# EAGLE design matrix (EAGLE 5.07)

## Sheet 1 of 2
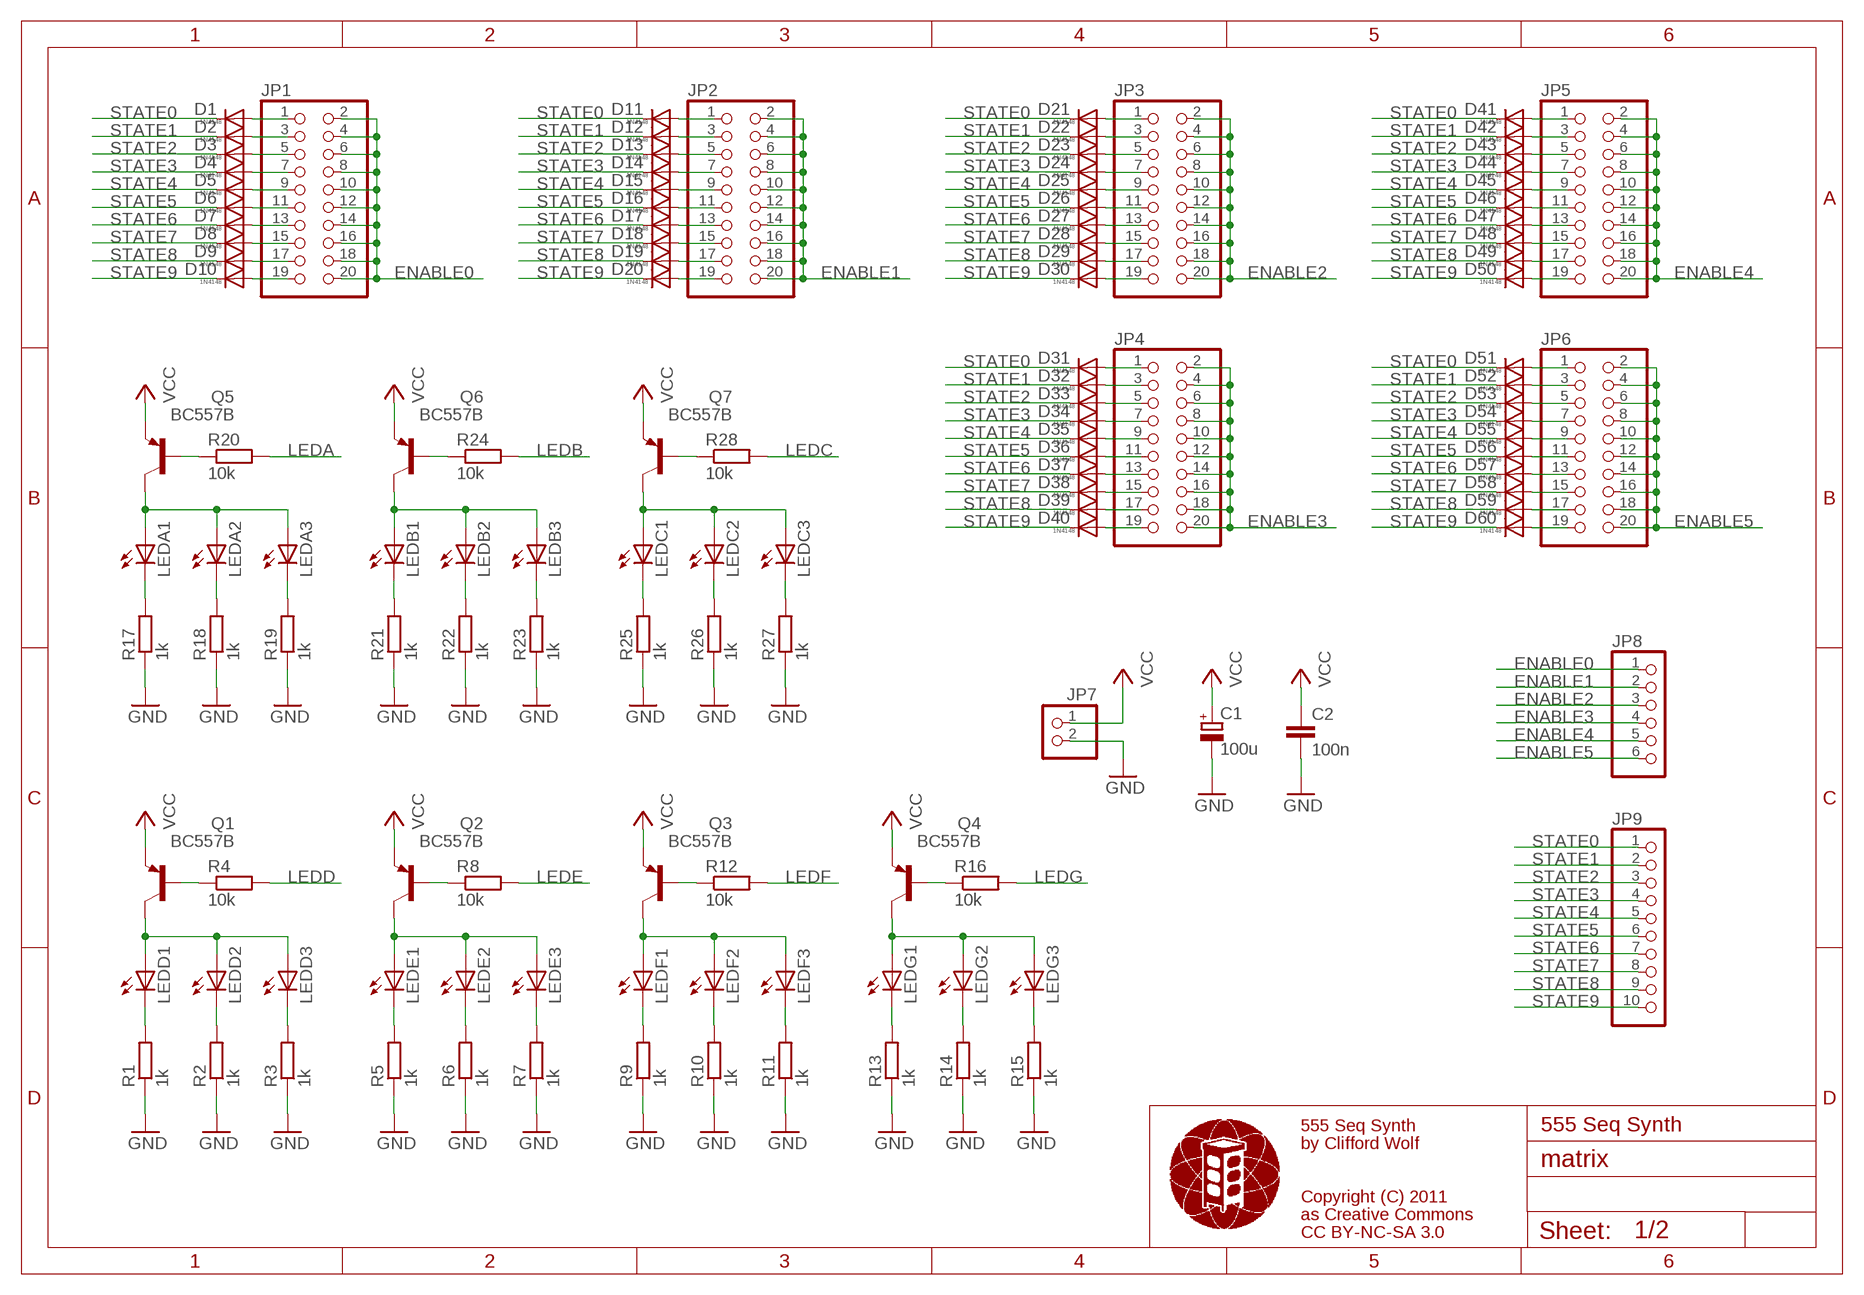
[diagram p0: schematic, sheet 1]

### Parts
C1  100u  CPOLE5-10,5L  [E5-10,5L]
C2  100n  C050-030X075  [C050-030X075]
D1  1N4148  [DO35-7]
D2  1N4148  [DO35-7]
D3  1N4148  [DO35-7]
D4  1N4148  [DO35-7]
D5  1N4148  [DO35-7]
D6  1N4148  [DO35-7]
D7  1N4148  [DO35-7]
D8  1N4148  [DO35-7]
D9  1N4148  [DO35-7]
D10  1N4148  [DO35-7]
D11  1N4148  [DO35-7]
D12  1N4148  [DO35-7]
D13  1N4148  [DO35-7]
D14  1N4148  [DO35-7]
D15  1N4148  [DO35-7]
D16  1N4148  [DO35-7]
D17  1N4148  [DO35-7]
D18  1N4148  [DO35-7]
D19  1N4148  [DO35-7]
D20  1N4148  [DO35-7]
D21  1N4148  [DO35-7]
D22  1N4148  [DO35-7]
D23  1N4148  [DO35-7]
D24  1N4148  [DO35-7]
D25  1N4148  [DO35-7]
D26  1N4148  [DO35-7]
D27  1N4148  [DO35-7]
D28  1N4148  [DO35-7]
D29  1N4148  [DO35-7]
D30  1N4148  [DO35-7]
D31  1N4148  [DO35-7]
D32  1N4148  [DO35-7]
D33  1N4148  [DO35-7]
D34  1N4148  [DO35-7]
D35  1N4148  [DO35-7]
D36  1N4148  [DO35-7]
D37  1N4148  [DO35-7]
D38  1N4148  [DO35-7]
D39  1N4148  [DO35-7]
D40  1N4148  [DO35-7]
D41  1N4148  [DO35-7]
D42  1N4148  [DO35-7]
D43  1N4148  [DO35-7]
D44  1N4148  [DO35-7]
D45  1N4148  [DO35-7]
D46  1N4148  [DO35-7]
D47  1N4148  [DO35-7]
D48  1N4148  [DO35-7]
D49  1N4148  [DO35-7]
D50  1N4148  [DO35-7]
D51  1N4148  [DO35-7]
D52  1N4148  [DO35-7]
D53  1N4148  [DO35-7]
D54  1N4148  [DO35-7]
D55  1N4148  [DO35-7]
D56  1N4148  [DO35-7]
D57  1N4148  [DO35-7]
D58  1N4148  [DO35-7]
D59  1N4148  [DO35-7]
D60  1N4148  [DO35-7]
JP1  PINHD-2X10  [2X10]
JP2  PINHD-2X10  [2X10]
JP3  PINHD-2X10  [2X10]
JP4  PINHD-2X10  [2X10]
JP5  PINHD-2X10  [2X10]
JP6  PINHD-2X10  [2X10]
JP7  PINHD-1X2  [1X02]
JP8  PINHD-1X6  [1X06]
JP9  PINHD-1X10  [1X10]
LEDA1  LED5MM  [LED5MM]
LEDA2  LED5MM  [LED5MM]
LEDA3  LED5MM  [LED5MM]
LEDB1  LED5MM  [LED5MM]
LEDB2  LED5MM  [LED5MM]
LEDB3  LED5MM  [LED5MM]
LEDC1  LED5MM  [LED5MM]
LEDC2  LED5MM  [LED5MM]
LEDC3  LED5MM  [LED5MM]
LEDD1  LED5MM  [LED5MM]
LEDD2  LED5MM  [LED5MM]
LEDD3  LED5MM  [LED5MM]
LEDE1  LED5MM  [LED5MM]
LEDE2  LED5MM  [LED5MM]
LEDE3  LED5MM  [LED5MM]
LEDF1  LED5MM  [LED5MM]
LEDF2  LED5MM  [LED5MM]
LEDF3  LED5MM  [LED5MM]
LEDG1  LED5MM  [LED5MM]
LEDG2  LED5MM  [LED5MM]
LEDG3  LED5MM  [LED5MM]
Q1  BC557B  [TO92]
Q2  BC557B  [TO92]
Q3  BC557B  [TO92]
Q4  BC557B  [TO92]
Q5  BC557B  [TO92]
Q6  BC557B  [TO92]
Q7  BC557B  [TO92]
R1  1k  R0309/10  [0309/10]
R2  1k  R0309/10  [0309/10]
R3  1k  R0309/10  [0309/10]
R4  10k  R0309/10  [0309/10]
R5  1k  R0309/10  [0309/10]
R6  1k  R0309/10  [0309/10]
R7  1k  R0309/10  [0309/10]
R8  10k  R0309/10  [0309/10]
R9  1k  R0309/10  [0309/10]
R10  1k  R0309/10  [0309/10]
R11  1k  R0309/10  [0309/10]
R12  10k  R0309/10  [0309/10]
R13  1k  R0309/10  [0309/10]
R14  1k  R0309/10  [0309/10]
R15  1k  R0309/10  [0309/10]
R16  10k  R0309/10  [0309/10]
R17  1k  R0309/10  [0309/10]
R18  1k  R0309/10  [0309/10]
R19  1k  R0309/10  [0309/10]
R20  10k  R0309/10  [0309/10]
R21  1k  R0309/10  [0309/10]
R22  1k  R0309/10  [0309/10]
R23  1k  R0309/10  [0309/10]
R24  10k  R0309/10  [0309/10]
R25  1k  R0309/10  [0309/10]
R26  1k  R0309/10  [0309/10]
R27  1k  R0309/10  [0309/10]
R28  10k  R0309/10  [0309/10]

### Nets
ENABLE0: JP1.2 JP1.4 JP1.6 JP1.8 JP1.10 JP1.12 JP1.14 JP1.16 JP1.18 JP1.20 JP8.1
ENABLE1: JP2.2 JP2.4 JP2.6 JP2.8 JP2.10 JP2.12 JP2.14 JP2.16 JP2.18 JP2.20 JP8.2
ENABLE2: JP3.2 JP3.4 JP3.6 JP3.8 JP3.10 JP3.12 JP3.14 JP3.16 JP3.18 JP3.20 JP8.3
ENABLE3: JP4.2 JP4.4 JP4.6 JP4.8 JP4.10 JP4.12 JP4.14 JP4.16 JP4.18 JP4.20 JP8.4
ENABLE4: JP5.2 JP5.4 JP5.6 JP5.8 JP5.10 JP5.12 JP5.14 JP5.16 JP5.18 JP5.20 JP8.5
ENABLE5: JP6.2 JP6.4 JP6.6 JP6.8 JP6.10 JP6.12 JP6.14 JP6.16 JP6.18 JP6.20 JP8.6
GND [pwr]: C1.- C2.2 JP7.2 R1.1 R2.1 R3.1 R5.1 R6.1 R7.1 R9.1 R10.1 R11.1 R13.1 R14.1 R15.1 R17.1 R18.1 R19.1 R21.1 R22.1 R23.1 R25.1 R26.1 R27.1
LEDA: R20.2 ; also sheet 2
LEDB: R24.2 ; also sheet 2
LEDC: R28.2 ; also sheet 2
LEDD: R4.2 ; also sheet 2
LEDE: R8.2 ; also sheet 2
LEDF: R12.2 ; also sheet 2
LEDG: R16.2 ; also sheet 2
N$1: D1.A JP1.1
N$2: D2.A JP1.3
N$3: D3.A JP1.5
N$4: D4.A JP1.7
N$5: D5.A JP1.9
N$6: D6.A JP1.11
N$7: D7.A JP1.13
N$8: D8.A JP1.15
N$9: D9.A JP1.17
N$10: D10.A JP1.19
N$11: D11.A JP2.1
N$12: D12.A JP2.3
N$13: D13.A JP2.5
N$14: D14.A JP2.7
N$15: D15.A JP2.9
N$16: D16.A JP2.11
N$17: D17.A JP2.13
N$18: D18.A JP2.15
N$19: D19.A JP2.17
N$20: D20.A JP2.19
N$21: D21.A JP3.1
N$22: D22.A JP3.3
N$23: D23.A JP3.5
N$24: D24.A JP3.7
N$25: D25.A JP3.9
N$26: D26.A JP3.11
N$27: D27.A JP3.13
N$28: D28.A JP3.15
N$29: D29.A JP3.17
N$30: D30.A JP3.19
N$31: D31.A JP4.1
N$32: D32.A JP4.3
N$33: D33.A JP4.5
N$34: D34.A JP4.7
N$35: D35.A JP4.9
N$36: D36.A JP4.11
N$37: D37.A JP4.13
N$38: D38.A JP4.15
N$39: D39.A JP4.17
N$40: D40.A JP4.19
N$41: D41.A JP5.1
N$42: D42.A JP5.3
N$43: D43.A JP5.5
N$44: D44.A JP5.7
N$45: D45.A JP5.9
N$46: D46.A JP5.11
N$47: D47.A JP5.13
N$48: D48.A JP5.15
N$49: D49.A JP5.17
N$50: D50.A JP5.19
N$51: D51.A JP6.1
N$52: D52.A JP6.3
N$53: D53.A JP6.5
N$54: D54.A JP6.7
N$55: D55.A JP6.9
N$56: D56.A JP6.11
N$57: D57.A JP6.13
N$58: D58.A JP6.15
N$59: D59.A JP6.17
N$60: D60.A JP6.19
N$61 [led]: LEDD1.K(C) R1.2
N$62 [led]: LEDD2.K(C) R2.2
N$63 [led]: LEDD3.K(C) R3.2
N$64 [led]: LEDE1.K(C) R5.2
N$65 [led]: LEDD1.A LEDD2.A LEDD3.A Q1.3(C)
N$66: Q1.2(B) R4.1
N$67 [led]: LEDE2.K(C) R6.2
N$68 [led]: LEDE3.K(C) R7.2
N$69 [led]: LEDE1.A LEDE2.A LEDE3.A Q2.3(C)
N$70: Q2.2(B) R8.1
N$71 [led]: LEDF1.K(C) R9.2
N$72 [led]: LEDF2.K(C) R10.2
N$73 [led]: LEDF3.K(C) R11.2
N$74 [led]: LEDF1.A LEDF2.A LEDF3.A Q3.3(C)
N$75: Q3.2(B) R12.1
N$76 [led]: LEDG1.K(C) R13.2
N$77 [led]: LEDG2.K(C) R14.2
N$78 [led]: LEDG3.K(C) R15.2
N$79 [led]: LEDG1.A LEDG2.A LEDG3.A Q4.3(C)
N$80: Q4.2(B) R16.1
N$81 [led]: LEDA1.K(C) R17.2
N$82 [led]: LEDA2.K(C) R18.2
N$83 [led]: LEDA3.K(C) R19.2
N$84 [led]: LEDA1.A LEDA2.A LEDA3.A Q5.3(C)
N$85: Q5.2(B) R20.1
N$86 [led]: LEDB1.K(C) R21.2
N$87 [led]: LEDB2.K(C) R22.2
N$88 [led]: LEDB3.K(C) R23.2
N$89 [led]: LEDB1.A LEDB2.A LEDB3.A Q6.3(C)
N$90: Q6.2(B) R24.1
N$91 [led]: LEDC1.K(C) R25.2
N$92 [led]: LEDC2.K(C) R26.2
N$93 [led]: LEDC3.K(C) R27.2
N$94 [led]: LEDC1.A LEDC2.A LEDC3.A Q7.3(C)
N$95: Q7.2(B) R28.1
STATE0: D1.C D11.C D21.C D31.C D41.C D51.C JP9.1 ; also sheet 2
STATE1: D2.C D12.C D22.C D32.C D42.C D52.C JP9.2 ; also sheet 2
STATE2: D3.C D13.C D23.C D33.C D43.C D53.C JP9.3 ; also sheet 2
STATE3: D4.C D14.C D24.C D34.C D44.C D54.C JP9.4 ; also sheet 2
STATE4: D5.C D15.C D25.C D35.C D45.C D55.C JP9.5 ; also sheet 2
STATE5: D6.C D16.C D26.C D36.C D46.C D56.C JP9.6 ; also sheet 2
STATE6: D7.C D17.C D27.C D37.C D47.C D57.C JP9.7 ; also sheet 2
STATE7: D8.C D18.C D28.C D38.C D48.C D58.C JP9.8 ; also sheet 2
STATE8: D9.C D19.C D29.C D39.C D49.C D59.C JP9.9 ; also sheet 2
STATE9: D10.C D20.C D30.C D40.C D50.C D60.C JP9.10 ; also sheet 2
VCC [pwr]: C1.+ C2.1 JP7.1 Q1.1(E) Q2.1(E) Q3.1(E) Q4.1(E) Q5.1(E) Q6.1(E) Q7.1(E)

### Notes on the sheet
- 555 Seq Synth | 555 Seq Synth
- by Clifford Wolf
- Copyright (C) 2011
- as Creative Commons
- CC BY-NC-SA 3.0

## Sheet 2 of 2
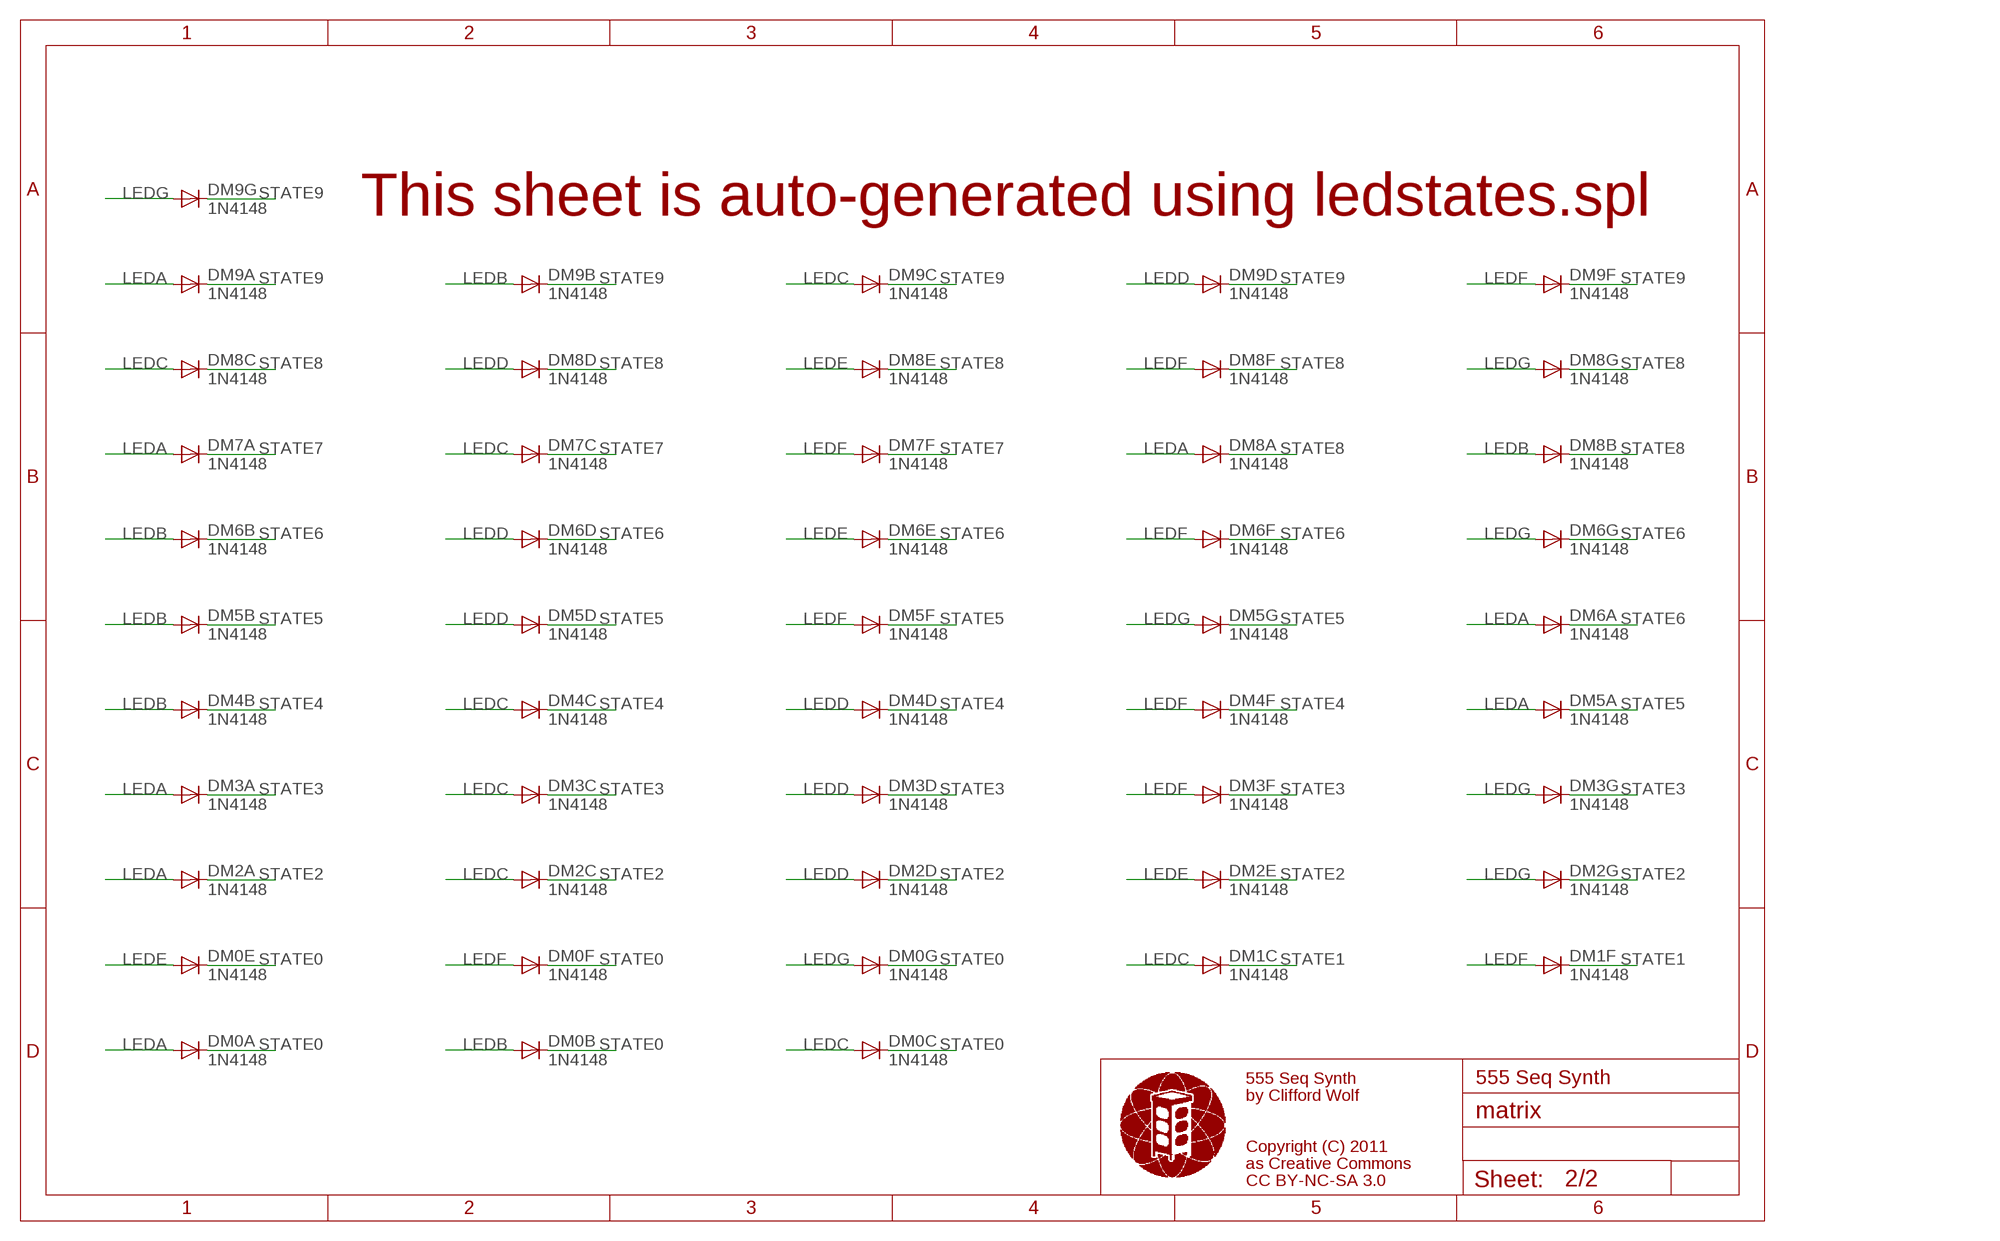
[diagram p1: schematic, sheet 2]

### Parts
DM0A  1N4148  [DO35-7]
DM0B  1N4148  [DO35-7]
DM0C  1N4148  [DO35-7]
DM0E  1N4148  [DO35-7]
DM0F  1N4148  [DO35-7]
DM0G  1N4148  [DO35-7]
DM1C  1N4148  [DO35-7]
DM1F  1N4148  [DO35-7]
DM2A  1N4148  [DO35-7]
DM2C  1N4148  [DO35-7]
DM2D  1N4148  [DO35-7]
DM2E  1N4148  [DO35-7]
DM2G  1N4148  [DO35-7]
DM3A  1N4148  [DO35-7]
DM3C  1N4148  [DO35-7]
DM3D  1N4148  [DO35-7]
DM3F  1N4148  [DO35-7]
DM3G  1N4148  [DO35-7]
DM4B  1N4148  [DO35-7]
DM4C  1N4148  [DO35-7]
DM4D  1N4148  [DO35-7]
DM4F  1N4148  [DO35-7]
DM5A  1N4148  [DO35-7]
DM5B  1N4148  [DO35-7]
DM5D  1N4148  [DO35-7]
DM5F  1N4148  [DO35-7]
DM5G  1N4148  [DO35-7]
DM6A  1N4148  [DO35-7]
DM6B  1N4148  [DO35-7]
DM6D  1N4148  [DO35-7]
DM6E  1N4148  [DO35-7]
DM6F  1N4148  [DO35-7]
DM6G  1N4148  [DO35-7]
DM7A  1N4148  [DO35-7]
DM7C  1N4148  [DO35-7]
DM7F  1N4148  [DO35-7]
DM8A  1N4148  [DO35-7]
DM8B  1N4148  [DO35-7]
DM8C  1N4148  [DO35-7]
DM8D  1N4148  [DO35-7]
DM8E  1N4148  [DO35-7]
DM8F  1N4148  [DO35-7]
DM8G  1N4148  [DO35-7]
DM9A  1N4148  [DO35-7]
DM9B  1N4148  [DO35-7]
DM9C  1N4148  [DO35-7]
DM9D  1N4148  [DO35-7]
DM9F  1N4148  [DO35-7]
DM9G  1N4148  [DO35-7]

### Nets
LEDA: DM0A.A DM2A.A DM3A.A DM5A.A DM6A.A DM7A.A DM8A.A DM9A.A ; also sheet 1
LEDB: DM0B.A DM4B.A DM5B.A DM6B.A DM8B.A DM9B.A ; also sheet 1
LEDC: DM0C.A DM1C.A DM2C.A DM3C.A DM4C.A DM7C.A DM8C.A DM9C.A ; also sheet 1
LEDD: DM2D.A DM3D.A DM4D.A DM5D.A DM6D.A DM8D.A DM9D.A ; also sheet 1
LEDE: DM0E.A DM2E.A DM6E.A DM8E.A ; also sheet 1
LEDF: DM0F.A DM1F.A DM3F.A DM4F.A DM5F.A DM6F.A DM7F.A DM8F.A DM9F.A ; also sheet 1
LEDG: DM0G.A DM2G.A DM3G.A DM5G.A DM6G.A DM8G.A DM9G.A ; also sheet 1
STATE0: DM0A.C DM0B.C DM0C.C DM0E.C DM0F.C DM0G.C ; also sheet 1
STATE1: DM1C.C DM1F.C ; also sheet 1
STATE2: DM2A.C DM2C.C DM2D.C DM2E.C DM2G.C ; also sheet 1
STATE3: DM3A.C DM3C.C DM3D.C DM3F.C DM3G.C ; also sheet 1
STATE4: DM4B.C DM4C.C DM4D.C DM4F.C ; also sheet 1
STATE5: DM5A.C DM5B.C DM5D.C DM5F.C DM5G.C ; also sheet 1
STATE6: DM6A.C DM6B.C DM6D.C DM6E.C DM6F.C DM6G.C ; also sheet 1
STATE7: DM7A.C DM7C.C DM7F.C ; also sheet 1
STATE8: DM8A.C DM8B.C DM8C.C DM8D.C DM8E.C DM8F.C DM8G.C ; also sheet 1
STATE9: DM9A.C DM9B.C DM9C.C DM9D.C DM9F.C DM9G.C ; also sheet 1

### Notes on the sheet
- This sheet is auto-generated using ledstates.spl
- 555 Seq Synth | 555 Seq Synth
- by Clifford Wolf
- Copyright (C) 2011
- as Creative Commons
- CC BY-NC-SA 3.0

## Library data of the parts
C1 = mp_passive:CPOL: POLARIZED CAPACITOR, European symbol
C2 = mp_passive:C: CAPACITOR, European symbol
D1-D60 DM0A DM0B DM0C DM0E DM0F DM0G DM1C DM1F DM2A DM2C DM2D DM2E DM2G DM3A DM3C DM3D DM3F DM3G DM4B DM4C DM4D DM4F DM5A DM5B DM5D DM5F DM5G DM6A DM6B DM6D DM6E DM6F DM6G DM7A DM7C DM7F DM8A DM8B DM8C DM8D DM8E DM8F DM8G DM9A DM9B DM9C DM9D DM9F DM9G = mp_diode:1N4148: Switching Diode
JP1-JP6 = mpc_pinhead:PINHD-2X10: PIN HEADER
JP7 = mpc_pinhead:PINHD-1X2: PIN HEADER
JP8 = mpc_pinhead:PINHD-1X6: PIN HEADER
JP9 = mpc_pinhead:PINHD-1X10: PIN HEADER
LEDA1-LEDA3 LEDB1-LEDB3 LEDC1-LEDC3 LEDD1-LEDD3 LEDE1-LEDE3 LEDF1-LEDF3 LEDG1-LEDG3 = mp_diode:LED: LED (5mm)
Q1-Q7 = mp_transistor:BC557B: PNP Transistor
R1-R28 = mp_passive:R: RESISTOR, European symbol

## Net classes
1 pwr: width 0.508 mm
2 led: width 0.381 mm

## Board
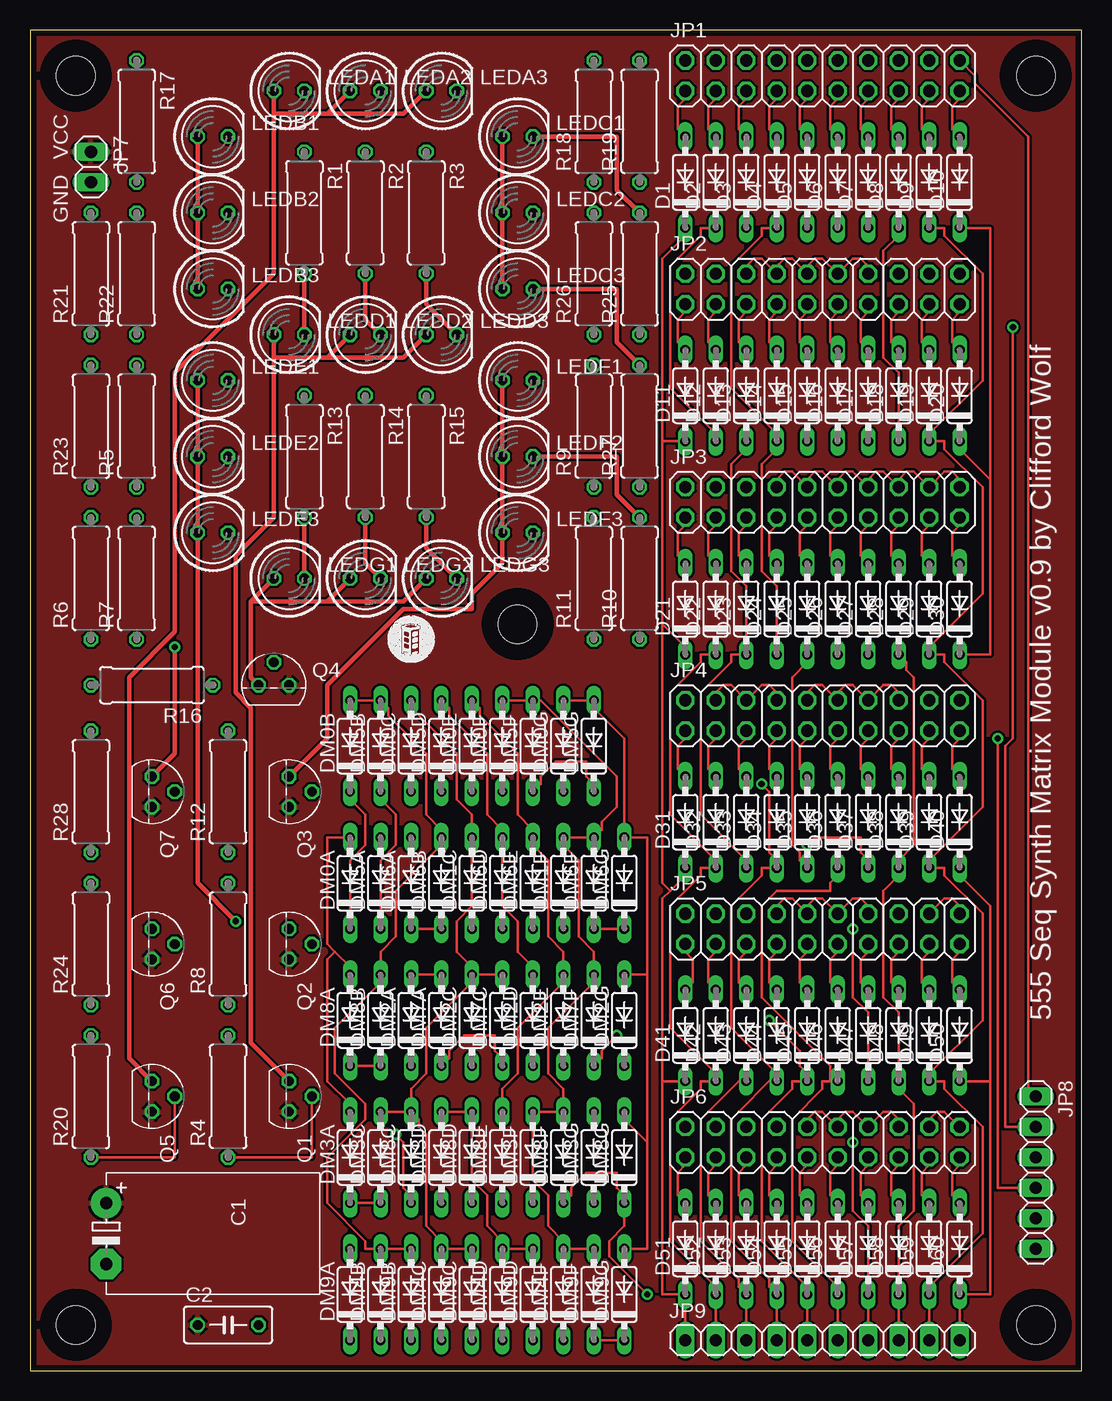
[diagram p2: board, top side]
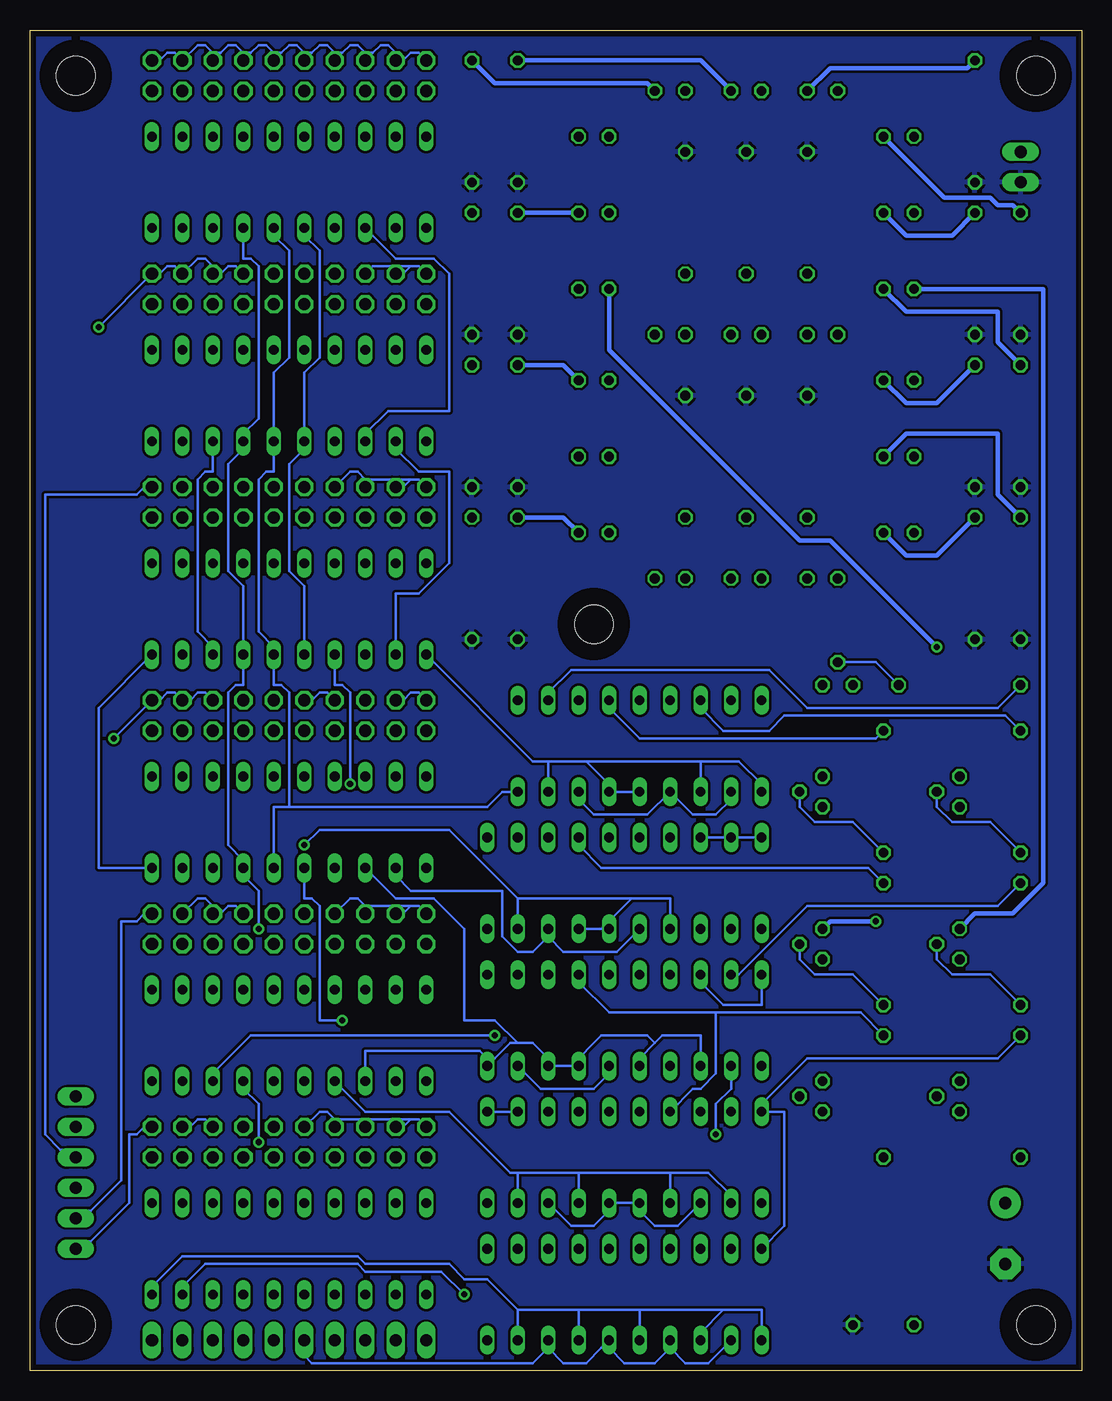
[diagram p3: board, bottom side, seen from below]

Size 87.63 x 111.76 mm. Coordinates in mm from the lower left corner, seen from the top.
Outline: 0,0 87.63,0 87.63,111.76 0,111.76 0,0
Copper layers (1*16): Top 0.035mm / dielectric 1.5mm / Bottom 0.035mm
Design rules "qp_designrules_8mil": minimum track width 8mil, minimum drill 20mil, track to track 8mil, track to pad 8mil, pad to pad 8mil, via to via 8mil, smd to smd 8mil, copper to edge 20mil, drill to drill 20mil, minimum pad ring 8mil, minimum via ring 8mil, stop-mask expansion 0mil, vias tented up to drill 0mil, thermal gap 10mil
Holes 3.2 mm at 83.82,107.95 83.82,3.81 3.81,3.81 3.81,107.95 40.64,62.23
tKeepout: area 81.8,106 to 85.8,110; area 81.8,1.8 to 85.8,5.8; area 1.8,1.8 to 5.8,5.8; area 1.8,106 to 5.8,110; area 38.6,60.2 to 42.6,64.2
bKeepout: area 81.8,106 to 85.8,110; area 81.8,1.8 to 85.8,5.8; area 1.8,1.8 to 5.8,5.8; area 1.8,106 to 5.8,110; area 38.6,60.2 to 42.6,64.2
tRestrict: area 81.8,106 to 85.8,110; area 81.8,1.8 to 85.8,5.8; area 1.8,1.8 to 5.8,5.8; area 1.8,106 to 5.8,110; area 38.6,60.2 to 42.6,64.2
bRestrict: area 81.8,106 to 85.8,110; area 81.8,1.8 to 85.8,5.8; area 1.8,1.8 to 5.8,5.8; area 1.8,106 to 5.8,110; area 38.6,60.2 to 42.6,64.2
vRestrict: area 81.8,106 to 85.8,110; area 81.8,1.8 to 85.8,5.8; area 1.8,1.8 to 5.8,5.8; area 1.8,106 to 5.8,110; area 38.6,60.2 to 42.6,64.2

### Footprints (pad centres in the part's own frame; a part is rotated, then mirrored left to right if it is on the bottom)
E5-10,5L = drill 1.016 pad 2.54 round: + -2.54,0 | drill 1.016 pad 2.54 octagon: - 2.54,0
C050-030X075 = drill 0.813 octagon: 1 -2.54,0; 2 2.54,0
DO35-7 = drill 0.813 long: A 3.81,0; C -3.81,0
2X10 = drill 1.016 octagon: 1 -11.43,-1.27; 2 -11.43,1.27; 3 -8.89,-1.27; 4 -8.89,1.27; 5 -6.35,-1.27; 6 -6.35,1.27; 7 -3.81,-1.27; 8 -3.81,1.27; 9 -1.27,-1.27; 10 -1.27,1.27; 11 1.27,-1.27; 12 1.27,1.27; 13 3.81,-1.27; 14 3.81,1.27; 15 6.35,-1.27; 16 6.35,1.27; 17 8.89,-1.27; 18 8.89,1.27; 19 11.43,-1.27; 20 11.43,1.27
1X02 = drill 1.016 long: 1 -1.27,0; 2 1.27,0
1X06 = drill 1.016 long: 1 -6.35,0; 2 -3.81,0; 3 -1.27,0; 4 1.27,0; 5 3.81,0; 6 6.35,0
1X10 = drill 1.016 long: 1 -11.43,0; 2 -8.89,0; 3 -6.35,0; 4 -3.81,0; 5 -1.27,0; 6 1.27,0; 7 3.81,0; 8 6.35,0; 9 8.89,0; 10 11.43,0
LED5MM = drill 0.813 octagon: A -1.27,0; K 1.27,0
TO92 = drill 0.813 octagon: 1 1.27,0; 2 0,1.905; 3 -1.27,0
0309/10 = drill 0.813 octagon: 1 -5.08,0; 2 5.08,0

### Placement (x,y rotation side)
C1  6.35,11.43 270 top
C2  16.51,3.81 0 top
D1  54.61,99.06 90 top
D2  57.15,99.06 90 top
D3  59.69,99.06 90 top
D4  62.23,99.06 90 top
D5  64.77,99.06 90 top
D6  67.31,99.06 90 top
D7  69.85,99.06 90 top
D8  72.39,99.06 90 top
D9  74.93,99.06 90 top
D10  77.47,99.06 90 top
D11  54.61,81.28 90 top
D12  57.15,81.28 90 top
D13  59.69,81.28 90 top
D14  62.23,81.28 90 top
D15  64.77,81.28 90 top
D16  67.31,81.28 90 top
D17  69.85,81.28 90 top
D18  72.39,81.28 90 top
D19  74.93,81.28 90 top
D20  77.47,81.28 90 top
D21  54.61,63.5 90 top
D22  57.15,63.5 90 top
D23  59.69,63.5 90 top
D24  62.23,63.5 90 top
D25  64.77,63.5 90 top
D26  67.31,63.5 90 top
D27  69.85,63.5 90 top
D28  72.39,63.5 90 top
D29  74.93,63.5 90 top
D30  77.47,63.5 90 top
D31  54.61,45.72 90 top
D32  57.15,45.72 90 top
D33  59.69,45.72 90 top
D34  62.23,45.72 90 top
D35  64.77,45.72 90 top
D36  67.31,45.72 90 top
D37  69.85,45.72 90 top
D38  72.39,45.72 90 top
D39  74.93,45.72 90 top
D40  77.47,45.72 90 top
D41  54.61,27.94 90 top
D42  57.15,27.94 90 top
D43  59.69,27.94 90 top
D44  62.23,27.94 90 top
D45  64.77,27.94 90 top
D46  67.31,27.94 90 top
D47  69.85,27.94 90 top
D48  72.39,27.94 90 top
D49  74.93,27.94 90 top
D50  77.47,27.94 90 top
D51  54.61,10.16 90 top
D52  57.15,10.16 90 top
D53  59.69,10.16 90 top
D54  62.23,10.16 90 top
D55  64.77,10.16 90 top
D56  67.31,10.16 90 top
D57  69.85,10.16 90 top
D58  72.39,10.16 90 top
D59  74.93,10.16 90 top
D60  77.47,10.16 90 top
DM0A  26.67,40.64 90 top
DM0B  26.67,52.07 90 top
DM0C  31.75,52.07 90 top
DM0E  36.83,52.07 90 top
DM0F  39.37,52.07 90 top
DM0G  44.45,52.07 90 top
DM1C  36.83,40.64 90 top
DM1F  44.45,40.64 90 top
DM2A  31.75,29.21 90 top
DM2C  36.83,29.21 90 top
DM2D  41.91,29.21 90 top
DM2E  44.45,29.21 90 top
DM2G  49.53,29.21 90 top
DM3A  26.67,17.78 90 top
DM3C  29.21,17.78 90 top
DM3D  34.29,17.78 90 top
DM3F  41.91,17.78 90 top
DM3G  46.99,17.78 90 top
DM4B  29.21,6.35 90 top
DM4C  34.29,6.35 90 top
DM4D  39.37,6.35 90 top
DM4F  44.45,6.35 90 top
DM5A  29.21,40.64 90 top
DM5B  29.21,52.07 90 top
DM5D  34.29,52.07 90 top
DM5F  41.91,52.07 90 top
DM5G  46.99,52.07 90 top
DM6A  31.75,40.64 90 top
DM6B  34.29,40.64 90 top
DM6D  39.37,40.64 90 top
DM6E  41.91,40.64 90 top
DM6F  46.99,40.64 90 top
DM6G  49.53,40.64 90 top
DM7A  34.29,29.21 90 top
DM7C  39.37,29.21 90 top
DM7F  46.99,29.21 90 top
DM8A  26.67,29.21 90 top
DM8B  29.21,29.21 90 top
DM8C  31.75,17.78 90 top
DM8D  36.83,17.78 90 top
DM8E  39.37,17.78 90 top
DM8F  44.45,17.78 90 top
DM8G  49.53,17.78 90 top
DM9A  26.67,6.35 90 top
DM9B  31.75,6.35 90 top
DM9C  36.83,6.35 90 top
DM9D  41.91,6.35 90 top
DM9F  46.99,6.35 90 top
DM9G  49.53,6.35 90 top
JP1  66.04,107.95 0 top
JP2  66.04,90.17 0 top
JP3  66.04,72.39 0 top
JP4  66.04,54.61 0 top
JP5  66.04,36.83 0 top
JP6  66.04,19.05 0 top
JP7  5.08,100.33 270 top
JP8  83.82,16.51 270 top
JP9  66.04,2.54 0 top
LEDA1  21.59,106.68 0 top
LEDA2  27.94,106.68 0 top
LEDA3  34.29,106.68 0 top
LEDB1  15.24,102.87 0 top
LEDB2  15.24,96.52 0 top
LEDB3  15.24,90.17 0 top
LEDC1  40.64,102.87 0 top
LEDC2  40.64,96.52 0 top
LEDC3  40.64,90.17 0 top
LEDD1  21.59,86.36 0 top
LEDD2  27.94,86.36 0 top
LEDD3  34.29,86.36 0 top
LEDE1  15.24,82.55 0 top
LEDE2  15.24,76.2 0 top
LEDE3  15.24,69.85 0 top
LEDF1  40.64,82.55 0 top
LEDF2  40.64,76.2 0 top
LEDF3  40.64,69.85 0 top
LEDG1  21.59,66.04 0 top
LEDG2  27.94,66.04 0 top
LEDG3  34.29,66.04 0 top
Q1  21.59,22.86 270 top
Q2  21.59,35.56 270 top
Q3  21.59,48.26 270 top
Q4  20.32,57.15 0 top
Q5  10.16,22.86 270 top
Q6  10.16,35.56 270 top
Q7  10.16,48.26 270 top
R1  22.86,96.52 270 top
R2  27.94,96.52 270 top
R3  33.02,96.52 270 top
R4  16.51,22.86 90 top
R5  8.89,78.74 90 top
R6  5.08,66.04 90 top
R7  8.89,66.04 90 top
R8  16.51,35.56 90 top
R9  46.99,78.74 90 top
R10  50.8,66.04 90 top
R11  46.99,66.04 90 top
R12  16.51,48.26 90 top
R13  22.86,76.2 270 top
R14  27.94,76.2 270 top
R15  33.02,76.2 270 top
R16  10.16,57.15 180 top
R17  8.89,104.14 90 top
R18  46.99,104.14 90 top
R19  50.8,104.14 90 top
R20  5.08,22.86 90 top
R21  5.08,91.44 90 top
R22  8.89,91.44 90 top
R23  5.08,78.74 90 top
R24  5.08,35.56 90 top
R25  50.8,91.44 90 top
R26  46.99,91.44 90 top
R27  50.8,78.74 90 top
R28  5.08,48.26 90 top
U$1  [METALAB]  31.75,60.96 0 top

### Tracks (layer width: path | path; a pad name or v marks a point on that pad's centre or on a via)
ENABLE0
  Top 0.203: JP8.1 83.19,23.5 83.19,102.87 78.74,107.31 78.74,107.95 JP1.20
  Bottom 0.203: JP1.2 55.24,109.86 55.88,109.86 56.52,109.22 | 59.05,109.86 58.42,110.49 57.78,110.49 56.52,109.22 | 59.05,109.86 JP1.6 | 56.52,109.22 JP1.4 | 61.59,109.86 60.96,110.49 60.33,110.49 59.69,109.86 59.05,109.86 | 61.59,109.86 JP1.8 | 64.14,109.86 63.5,110.49 62.87,110.49 62.23,109.86 61.59,109.86 | 64.14,109.86 JP1.10 | 66.67,109.86 66.04,110.49 65.41,110.49 64.77,109.86 64.14,109.86 | 66.67,109.86 JP1.12 | 69.22,109.86 68.58,110.49 67.94,110.49 67.31,109.86 66.67,109.86 | 69.22,109.86 JP1.14 | 71.75,109.86 71.12,110.49 70.48,110.49 69.85,109.86 69.22,109.86 | 71.75,109.86 JP1.16 | 71.75,109.86 72.39,109.86 73.03,110.49 73.66,110.49 JP1.18 75.56,109.86 76.2,109.86 76.83,109.22 JP1.20
ENABLE1  (via drill 0.51)
  Top 0.203: JP2.6 59.69,92.08 60.33,92.71 60.96,92.71 JP2.8 62.23,92.08 62.87,92.71 63.5,92.71 JP2.10 64.77,92.08 65.41,92.71 66.04,92.71 JP2.12 68.58,92.71 69.22,92.71 69.85,92.08 JP2.14 | JP8.2 81.28,20.32 81.28,52.07 81.92,52.7 v81.92,87
  Bottom 0.203: JP2.2 55.24,92.08 55.88,92.08 | 55.88,92.08 56.52,91.44 JP2.4 | JP2.6 59.05,92.08 55.88,92.08 | JP2.14 70.48,92.08 71.12,92.08 71.75,91.44 | 71.75,91.44 73.03,92.71 73.66,92.71 JP2.18 75.56,92.08 76.2,92.08 76.83,91.44 JP2.20 v81.92,87 | 71.75,91.44 JP2.16
ENABLE2
  Top 0.203: JP3.8 62.23,74.3 62.87,74.93 63.5,74.93 JP3.10 64.77,74.3 65.41,74.93 66.04,74.93 JP3.12 67.31,74.3 67.94,74.93 68.58,74.93 JP3.14 69.85,74.3 70.48,74.93 71.12,74.93 JP3.16 72.39,74.3 73.03,74.93 73.66,74.93 JP3.18 76.2,74.93 76.83,74.93 77.47,74.3 JP3.20
  Bottom 0.203: JP3.2 55.24,74.3 55.88,74.3 | 55.88,74.3 56.52,73.66 JP3.4 | 59.05,74.3 JP3.6 | 59.05,74.3 55.88,74.3 | JP3.8 60.96,74.93 60.33,74.93 59.69,74.3 59.05,74.3 | JP8.3 84.45,18.41 85.09,18.41 86.36,19.68 86.36,73.03 78.74,73.03 78.11,73.66 JP3.20
ENABLE3  (via drill 0.51)
  Top 0.203: JP4.4 57.15,56.52 57.78,57.15 58.42,57.15 JP4.6 60.96,57.15 61.59,57.15 62.23,56.52 JP4.8 | JP4.10 64.77,56.52 65.41,57.15 66.04,57.15 JP4.12 67.31,56.52 67.94,57.15 68.58,57.15 JP4.14 71.12,57.15 71.75,57.15 72.39,56.52 JP4.16 | JP8.4 80.64,15.24 v80.64,52.7
  Bottom 0.203: JP4.2 55.24,56.52 55.88,56.52 56.52,55.88 JP4.4 | JP4.8 62.87,56.52 63.5,56.52 64.14,55.88 JP4.10 | JP4.16 73.03,56.52 73.66,56.52 74.3,55.88 JP4.18 75.56,56.52 76.2,56.52 76.83,55.88 JP4.20 v80.64,52.7
ENABLE4
  Top 0.203: JP5.8 62.23,38.73 62.87,39.37 63.5,39.37 JP5.10 64.77,38.73 65.41,39.37 66.04,39.37 JP5.12 68.58,39.37 69.22,39.37 69.85,38.73 JP5.14 | JP5.18 76.2,39.37 76.83,39.37 77.47,38.73 JP5.20
  Bottom 0.203: JP5.2 55.24,38.73 55.88,38.73 | 55.88,38.73 56.52,38.1 JP5.4 | 59.05,38.73 JP5.6 | 55.88,38.73 59.05,38.73 | JP5.8 60.96,39.37 60.33,39.37 59.69,38.73 59.05,38.73 | JP5.14 70.48,38.73 71.12,38.73 71.75,38.1 | JP5.18 73.66,39.37 73.03,39.37 71.75,38.1 | 71.75,38.1 JP5.16 | JP8.5 83.19,13.34 82.55,13.34 80.01,15.88 80.01,37.47 78.74,37.47 78.11,38.1 JP5.20
ENABLE5
  Top 0.203: JP6.10 64.77,20.95 65.41,21.59 66.04,21.59 JP6.12 67.31,20.95 67.94,21.59 68.58,21.59 JP6.14 71.12,21.59 71.75,21.59 72.39,20.95 JP6.16 | JP6.20 76.2,21.59 75.56,21.59 74.93,20.95 JP6.18
  Bottom 0.203: JP6.2 55.24,20.95 55.88,20.95 | 55.88,20.95 56.52,20.32 JP6.4 | 59.05,20.95 JP6.6 | 55.88,20.95 59.05,20.95 | 61.59,20.95 JP6.8 | 59.05,20.95 61.59,20.95 | JP6.10 63.5,21.59 62.87,21.59 62.23,20.95 61.59,20.95 | JP6.16 73.03,20.95 73.66,20.95 74.3,20.32 JP6.18 | JP8.6 83.19,10.79 82.55,10.79 79.38,13.97 79.38,19.68 78.74,19.68 78.11,20.32 JP6.20
GND
  pour Bottom: 0,111.76 87.63,111.76 87.63,0 0,0
LEDA
  Top 0.203: DM2A.A DM7A.A | DM0A.A 24.77,44.45 24.77,35.56 25.4,34.92 | 25.4,34.92 26.67,33.66 DM8A.A | 25.4,34.92 24.77,34.29 24.77,24.13 26.67,22.23 DM3A.A
  Bottom 0.203: DM0A.A DM5A.A DM6A.A | DM8A.A 26.67,30.48 29.84,30.48 31.75,32.38 DM2A.A | DM9A.A 24.77,12.06 24.77,21.59 DM3A.A 26.67,22.23 22.86,26.04 6.99,26.04 R20.2
LEDB
  Top 0.203: DM9B.A DM4B.A 27.94,10.16 27.94,10.79 24.77,13.97 24.77,17.78 27.94,20.95 27.94,22.23 25.4,24.77 25.4,28.57 29.21,32.38 DM8B.A 29.21,34.92 30.48,36.2 30.48,40.01 34.29,43.81 DM6B.A 34.29,45.09 33.02,46.35 33.02,51.44 29.84,54.61 29.84,55.24 DM5B.A DM0B.A
  Bottom 0.203: R24.2 6.99,38.73 22.86,38.73 28.57,33.02 DM8B.A
LEDC
  Top 0.203: DM8C.A DM3C.A | DM9C.A DM4C.A 34.29,10.79 33.02,12.06 33.02,19.68 32.38,20.32 32.38,20.95 DM8C.A | DM2C.A DM7C.A | DM2C.A 36.83,33.66 35.56,34.92 35.56,37.47 36.83,38.73 DM1C.A 36.83,46.35 35.56,47.62 35.56,51.44 31.75,55.24 DM0C.A | DM8C.A 31.75,23.5 33.02,24.77 33.02,28.57 36.83,32.38 DM2C.A
  Bottom 0.203: R28.2 6.35,54.61 24.77,54.61 26.04,53.34 29.84,53.34 31.75,55.24 DM0C.A
LEDD
  Top 0.203: DM3D.A DM8D.A 36.83,15.88 38.1,14.61 38.1,12.06 39.37,10.79 DM4D.A DM9D.A | DM2D.A 41.91,33.66 40.64,34.92 40.64,37.47 39.37,38.73 DM6D.A 39.37,45.09 38.1,46.35 38.1,51.44 34.92,54.61 34.92,55.24 DM5D.A
  Bottom 0.203: R4.2 18.41,29.84 30.48,29.84 | 30.48,29.84 39.37,29.84 41.91,32.38 DM2D.A | DM3D.A 32.38,23.5 31.75,23.5 30.48,24.77 30.48,29.84
LEDE
  Top 0.203: DM8E.A 39.37,23.5 40.64,24.77 40.64,28.57 44.45,32.38 DM2E.A 44.45,34.92 43.18,36.2 43.18,42.55 41.91,43.81 DM6E.A 41.91,45.09 40.64,46.35 40.64,51.44 37.47,54.61 37.47,55.24 DM0E.A
  Bottom 0.203: R8.2 17.78,41.91 40.01,41.91 41.91,43.81 DM6E.A
LEDF
  Top 0.203: DM9F.A DM4F.A 44.45,10.79 43.18,12.06 43.18,14.61 41.91,15.88 DM3F.A DM8F.A 44.45,23.5 43.18,24.77 43.18,28.57 46.99,32.38 DM7F.A 46.99,34.92 45.72,36.2 45.72,42.55 44.45,43.81 DM1F.A DM6F.A 47.62,45.09 47.62,45.72 48.9,46.99 48.9,49.53 42.55,55.88 DM5F.A DM0F.A
  Bottom 0.203: R12.2 17.14,52.7 36.83,52.7 39.37,55.24 DM0F.A
LEDG
  Top 0.203: DM9G.A 51.44,10.16 51.44,19.05 | 51.44,19.05 49.53,20.95 DM8G.A | 51.44,33.02 DM2G.A | 51.44,19.05 51.44,33.02 | 51.44,33.02 51.44,44.45 DM6G.A 49.53,52.7 46.99,55.24 DM5G.A DM0G.A
  Bottom 0.203: DM8G.A DM3G.A | R16.2 6.99,55.24 22.86,55.24 26.04,58.42 42.55,58.42 44.45,56.52 DM0G.A
N$1
  Top 0.203: D1.A 53.98,103.5 53.98,105.41 54.61,106.05 JP1.1
N$2
  Top 0.203: D2.A 56.52,103.5 56.52,105.41 57.15,106.05 JP1.3
N$3
  Top 0.203: D3.A 59.05,103.5 59.05,105.41 59.69,106.05 JP1.5
N$4
  Top 0.203: D4.A 61.59,103.5 61.59,105.41 62.23,106.05 JP1.7
N$5
  Top 0.203: D5.A 64.14,103.5 64.14,105.41 64.77,106.05 JP1.9
N$6
  Top 0.203: D6.A 66.67,103.5 66.67,105.41 67.31,106.05 JP1.11
N$7
  Top 0.203: D7.A 69.22,103.5 69.22,105.41 69.85,106.05 JP1.13
N$8
  Top 0.203: D8.A 71.75,103.5 71.75,105.41 72.39,106.05 JP1.15
N$9
  Top 0.203: D9.A 74.3,103.5 74.3,105.41 74.93,106.05 JP1.17
N$10
  Top 0.203: D10.A 76.83,103.5 76.83,105.41 77.47,106.05 JP1.19
N$11
  Top 0.203: D11.A 53.98,85.72 53.98,87.63 54.61,88.27 JP2.1
N$12
  Top 0.203: D12.A 56.52,85.72 56.52,87.63 57.15,88.27 JP2.3
N$13
  Top 0.203: D13.A 59.05,85.72 59.05,87.63 59.69,88.27 JP2.5
N$14
  Top 0.203: D14.A 61.59,85.72 61.59,87.63 62.23,88.27 JP2.7
N$15
  Top 0.203: D15.A 64.14,85.72 64.14,87.63 64.77,88.27 JP2.9
N$16
  Top 0.203: D16.A 66.67,85.72 66.67,87.63 67.31,88.27 JP2.11
N$17
  Top 0.203: D17.A 69.22,85.72 69.22,87.63 69.85,88.27 JP2.13
N$18
  Top 0.203: D18.A 71.75,85.72 71.75,87.63 72.39,88.27 JP2.15
N$19
  Top 0.203: D19.A 74.3,85.72 74.3,87.63 74.93,88.27 JP2.17
N$20
  Top 0.203: D20.A 76.83,85.72 76.83,87.63 77.47,88.27 JP2.19
N$21
  Top 0.203: D21.A 53.98,67.94 53.98,69.85 54.61,70.48 JP3.1
N$22
  Top 0.203: D22.A 56.52,67.94 56.52,69.85 57.15,70.48 JP3.3
N$23
  Top 0.203: D23.A 59.05,67.94 59.05,69.85 59.69,70.48 JP3.5
N$24
  Top 0.203: D24.A 61.59,67.94 61.59,69.85 62.23,70.48 JP3.7
N$25
  Top 0.203: D25.A 64.14,67.94 64.14,69.85 64.77,70.48 JP3.9
N$26
  Top 0.203: D26.A 66.67,67.94 66.67,69.85 67.31,70.48 JP3.11
N$27
  Top 0.203: D27.A 69.22,67.94 69.22,69.85 69.85,70.48 JP3.13
N$28
  Top 0.203: D28.A 71.75,67.94 71.75,69.85 72.39,70.48 JP3.15
N$29
  Top 0.203: D29.A 74.3,67.94 74.3,69.85 74.93,70.48 JP3.17
N$30
  Top 0.203: D30.A 76.83,67.94 76.83,69.85 77.47,70.48 JP3.19
N$31
  Top 0.203: D31.A 53.98,50.16 53.98,52.07 54.61,52.7 JP4.1
N$32
  Top 0.203: D32.A 56.52,50.16 56.52,52.07 57.15,52.7 JP4.3
N$33
  Top 0.203: D33.A 59.05,50.16 59.05,52.07 59.69,52.7 JP4.5
N$34
  Top 0.203: D34.A 61.59,50.16 61.59,52.07 62.23,52.7 JP4.7
N$35
  Top 0.203: D35.A 64.14,50.16 64.14,52.07 64.77,52.7 JP4.9
N$36
  Top 0.203: D36.A 66.67,50.16 66.67,52.07 67.31,52.7 JP4.11
N$37
  Top 0.203: D37.A 69.22,50.16 69.22,52.07 69.85,52.7 JP4.13
N$38
  Top 0.203: D38.A 71.75,50.16 71.75,52.07 72.39,52.7 JP4.15
N$39
  Top 0.203: D39.A 74.3,50.16 74.3,52.07 74.93,52.7 JP4.17
N$40
  Top 0.203: D40.A 76.83,50.16 76.83,52.07 77.47,52.7 JP4.19
N$41
  Top 0.203: D41.A 55.24,32.38 55.24,34.29 54.61,34.92 JP5.1
N$42
  Top 0.203: D42.A 56.52,32.38 56.52,34.29 57.15,34.92 JP5.3
N$43
  Top 0.203: D43.A 59.05,32.38 59.05,34.29 59.69,34.92 JP5.5
N$44
  Top 0.203: D44.A 61.59,32.38 61.59,34.29 62.23,34.92 JP5.7
N$45
  Top 0.203: D45.A 64.14,32.38 64.14,34.29 64.77,34.92 JP5.9
N$46
  Top 0.203: D46.A 66.67,32.38 66.67,34.29 67.31,34.92 JP5.11
N$47
  Top 0.203: D47.A 69.22,32.38 69.22,34.29 69.85,34.92 JP5.13
N$48
  Top 0.203: D48.A 71.75,32.38 71.75,34.29 72.39,34.92 JP5.15
N$49
  Top 0.203: D49.A 74.3,32.38 74.3,34.29 74.93,34.92 JP5.17
N$50
  Top 0.203: D50.A 76.83,32.38 76.83,34.29 77.47,34.92 JP5.19
N$51
  Top 0.203: D51.A 53.98,14.61 53.98,16.51 54.61,17.14 JP6.1
N$52
  Top 0.203: D52.A 56.52,14.61 56.52,16.51 57.15,17.14 JP6.3
N$53
  Top 0.203: D53.A 59.05,14.61 59.05,16.51 59.69,17.14 JP6.5
N$54
  Top 0.203: D54.A 61.59,14.61 61.59,16.51 62.23,17.14 JP6.7
N$55
  Top 0.203: D55.A 64.14,14.61 64.14,16.51 64.77,17.14 JP6.9
N$56
  Top 0.203: D56.A 66.67,14.61 66.67,16.51 67.31,17.14 JP6.11
N$57
  Top 0.203: D57.A 69.22,14.61 69.22,16.51 69.85,17.14 JP6.13
N$58
  Top 0.203: D58.A 71.75,14.61 71.75,16.51 72.39,17.14 JP6.15
N$59
  Top 0.203: D59.A 74.3,14.61 74.3,16.51 74.93,17.14 JP6.17
N$60
  Top 0.203: D60.A 76.83,14.61 76.83,16.51 77.47,17.14 JP6.19
N$61
  Top 0.381: LEDD1.K R1.2
N$62
  Top 0.381: LEDD2.K 27.94,87.63 R2.2
N$63
  Top 0.381: LEDD3.K 33.02,88.9 R3.2
N$64
  Bottom 0.381: R5.2 12.06,80.64 14.61,80.64 LEDE1.K
N$65
  Top 0.381: Q1.3 18.41,27.3 18.41,55.24 17.14,56.52 17.14,67.94 20.32,71.12 20.32,84.45 | 20.32,84.45 LEDD1.A | 24.77,84.45 LEDD2.A | 20.32,84.45 24.77,84.45 | LEDD3.A 31.11,84.45 24.77,84.45
N$66
  Top 0.203: R4.1 23.5,17.78 Q1.2
N$67
  Bottom 0.381: R6.2 6.99,73.03 6.99,78.11 14.61,78.11 LEDE2.K
N$68
  Bottom 0.381: R7.2 12.06,67.94 14.61,67.94 LEDE3.K
N$69  (via drill 0.51)
  Top 0.381: LEDE1.A LEDE2.A LEDE3.A 13.97,40.64 v17.14,37.47
  Bottom 0.381: Q2.3 20.95,37.47 v17.14,37.47
N$70
  Bottom 0.203: R8.1 19.05,33.02 22.23,33.02 23.5,34.29 Q2.2
N$71
  Bottom 0.381: LEDF1.K 43.18,83.82 R9.2
N$72
  Top 0.381: LEDF2.K 48.9,76.2 48.9,73.03 R10.2
N$73
  Bottom 0.381: LEDF3.K 43.18,71.12 R11.2
N$74
  Top 0.381: LEDF1.A LEDF2.A LEDF3.A 39.37,67.31 36.83,64.77 36.83,63.5 31.11,63.5 24.77,57.15 24.77,52.7 Q3.3
N$75
  Bottom 0.203: R12.1 19.05,45.72 22.23,45.72 23.5,46.99 Q3.2
N$76
  Top 0.381: LEDG1.K R13.2
N$77
  Top 0.381: LEDG2.K 27.94,67.31 R14.2
N$78
  Top 0.381: LEDG3.K 33.02,68.58 R15.2
N$79
  Top 0.381: Q4.3 18.41,57.78 18.41,64.14 | 18.41,64.14 LEDG1.A | 24.77,64.14 LEDG2.A | 18.41,64.14 24.77,64.14 | LEDG3.A 31.11,64.14 24.77,64.14
N$80
  Bottom 0.203: R16.1 17.14,59.05 Q4.2
N$81
  Bottom 0.381: R17.2 9.53,108.58 20.95,108.58 LEDA1.K
N$82
  Bottom 0.381: LEDA2.K 31.75,109.22 R18.2
N$83
  Bottom 0.381: LEDA3.K 36.2,107.31 48.9,107.31 R19.2
N$84
  Top 0.381: Q5.3 8.26,26.04 8.26,57.78 12.06,61.59 12.06,83.19 20.32,91.44 20.32,104.78 | 20.32,104.78 LEDA1.A | 24.77,104.78 LEDA2.A | 20.32,104.78 24.77,104.78 | LEDA3.A 31.11,104.78 24.77,104.78
N$85
  Top 0.203: R20.1 12.06,17.78 Q5.2
N$86
  Bottom 0.381: R21.2 5.71,97.16 6.99,97.16 7.62,97.79 11.43,97.79 LEDB1.K
N$87
  Bottom 0.381: R22.2 10.79,94.61 14.61,94.61 LEDB2.K
N$88
  Bottom 0.381: R23.2 6.99,85.72 6.99,88.27 14.61,88.27 LEDB3.K
N$89
  Top 0.381: LEDB1.A LEDB2.A LEDB3.A
  Bottom 0.381: Q6.3 8.89,38.1 5.71,38.1 3.17,40.64 3.17,90.17 LEDB3.A
N$90
  Bottom 0.203: R24.1 7.62,33.02 10.79,33.02 12.06,34.29 Q6.2
N$91
  Top 0.381: LEDC1.K 48.9,102.87 48.9,98.42 R25.2
N$92
  Bottom 0.381: LEDC2.K R26.2
N$93
  Top 0.381: LEDC3.K 48.9,90.17 48.9,85.72 R27.2
N$94  (via drill 0.51)
  Top 0.381: LEDC1.A LEDC2.A LEDC3.A | Q7.3 12.06,51.44 v12.06,60.33
  Bottom 0.381: v12.06,60.33 20.95,69.22 23.5,69.22 39.37,85.09 LEDC3.A
N$95
  Bottom 0.203: R28.1 7.62,45.72 10.79,45.72 12.06,46.99 Q7.2
STATE0
  Top 0.203: JP9.1 D51.C 52.7,6.35 52.7,24.13 | 52.7,24.13 D41.C | 52.7,24.13 52.7,39.37 53.34,40.01 | 53.34,40.01 54.61,41.27 D31.C | 52.7,77.47 D11.C | 52.7,77.47 52.7,92.71 54.61,94.61 D1.C | DM0A.C 26.67,42.55 27.94,43.81 27.94,46.35 26.67,47.62 DM0B.C | 52.7,62.23 52.7,77.47 | 52.7,62.23 54.61,60.33 D21.C | 53.34,40.01 52.7,40.64 52.7,62.23
  Bottom 0.203: 31.75,50.8 DM0C.C | 31.75,50.8 28.57,50.8 26.67,48.9 DM0B.C | 38.73,48.26 DM0F.C | 38.73,48.26 DM0E.C | 44.45,50.8 DM0G.C | 44.45,50.8 41.27,50.8 | 41.27,50.8 38.73,48.26 | D21.C 45.72,50.8 44.45,50.8 | 41.27,50.8 31.75,50.8
STATE1
  Top 0.203: D2.C 55.88,95.25 55.88,94.61 53.34,92.08 53.34,81.92 57.15,78.11 D12.C | JP9.2 D52.C 57.15,6.99 53.34,10.79 53.34,20.95 55.88,23.5 55.88,24.13 D42.C 57.15,24.77 53.34,28.57 53.34,38.73 55.88,41.27 55.88,41.91 D32.C 57.15,42.55 53.34,46.35 53.34,56.52 55.88,59.05 55.88,59.69 D22.C
  Bottom 0.203: D22.C 57.15,64.77 55.24,64.77 52.7,67.31 52.7,74.93 55.24,74.93 57.15,76.83 D12.C | DM1C.C 38.73,34.92 43.18,34.92 44.45,36.2 | 44.45,36.2 45.72,34.92 46.99,34.92 48.26,36.2 48.26,40.01 55.88,40.01 57.15,41.27 D32.C | 44.45,36.2 DM1F.C
STATE2
  Top 0.203: D13.C 59.69,76.83 58.42,75.56 58.42,66.67 59.69,65.41 D23.C 58.42,59.69 58.42,59.05 55.88,56.52 55.88,46.35 59.69,42.55 D33.C | JP9.3 D53.C 59.05,6.99 59.05,7.62 55.88,10.79 55.88,20.95 59.05,24.13 D43.C
  Bottom 0.203: D3.C 57.15,92.71 53.98,92.71 52.7,91.44 52.7,80.01 57.78,80.01 59.69,78.11 D13.C | DM2A.C 31.75,27.94 34.92,27.94 35.56,27.3 | 35.56,27.3 36.83,26.04 DM2C.C | 43.81,25.4 DM2E.C | 42.55,25.4 43.81,25.4 | 42.55,25.4 DM2D.C | 48.9,26.04 47.62,27.3 46.99,27.3 | 48.9,26.04 DM2G.C | 46.99,27.3 45.72,27.3 43.81,25.4 | D43.C 59.69,26.67 50.16,26.67 49.53,26.04 48.9,26.04 | D33.C 57.15,39.37 53.98,39.37 51.44,36.83 51.44,29.21 48.9,29.21 46.99,27.3 | 35.56,27.3 36.2,27.94 40.01,27.94 42.55,25.4
STATE3  (via drill 0.51)
  Top 0.203: D24.C 62.23,65.41 60.96,66.67 60.96,75.56 62.23,76.83 D14.C 62.23,78.11 58.42,81.92 58.42,92.08 60.96,94.61 60.96,95.25 D4.C | JP9.4 D54.C 61.59,6.99 61.59,7.62 58.42,10.79 58.42,20.95 62.23,24.77 | DM3A.C DM3C.C | 62.23,24.77 58.42,28.57 58.42,38.73 60.96,41.27 60.96,41.91 D34.C 62.23,42.55 61.59,43.18 61.59,48.26 v60.96,48.9 | D44.C 62.23,24.77
  Bottom 0.203: 34.29,16.51 DM3D.C | 34.29,16.51 31.11,16.51 29.21,14.61 DM3C.C | 41.91,16.51 DM3F.C | 34.29,16.51 41.91,16.51 | 46.99,16.51 DM3G.C | 41.91,16.51 46.99,16.51 | D44.C 59.69,21.59 52.7,21.59 47.62,16.51 46.99,16.51 | D24.C 62.23,57.15 61.59,57.15 60.96,56.52 v60.96,48.9
STATE4  (via drill 0.51)
  Top 0.203: D35.C 64.14,42.55 64.14,43.18 63.5,43.81 63.5,57.78 64.77,59.05 D25.C | JP9.5 D55.C 64.77,6.99 60.96,10.79 60.96,20.95 63.5,23.5 63.5,24.13 D45.C 64.77,24.77 64.14,25.4 64.14,26.67 v61.59,29.21
  Bottom 0.203: D5.C 64.77,94.61 63.5,93.34 63.5,84.45 64.77,83.19 D15.C 64.77,76.83 66.04,75.56 66.04,66.67 64.77,65.41 D25.C | DM4B.C 31.11,0.64 33.02,0.64 34.29,1.91 | 40.01,1.91 41.27,0.64 43.18,0.64 44.45,1.91 | 40.01,1.91 DM4D.C | 34.29,1.91 35.56,0.64 38.1,0.64 39.37,1.91 40.01,1.91 | 34.29,1.91 DM4C.C | 44.45,1.91 45.72,0.64 64.14,0.64 64.77,1.27 JP9.5 | 44.45,1.91 DM4F.C | D35.C 64.77,39.37 64.14,39.37 63.5,38.73 63.5,29.21 v61.59,29.21
STATE5
  Top 0.203: JP9.6 D56.C 67.31,6.99 63.5,10.79 63.5,20.95 66.04,23.5 66.04,24.13 66.67,24.13 | 66.67,24.13 D46.C | DM5A.C 29.21,42.55 30.48,43.81 30.48,46.35 29.21,47.62 DM5B.C | DM5F.C 42.55,48.9 42.55,49.53 43.81,50.8 46.35,50.8 46.35,49.53 46.99,48.9 DM5G.C | 66.67,24.13 66.67,25.4 60.96,31.11 60.96,38.73 62.23,40.01 66.67,40.01 66.67,40.64 67.31,41.27 D36.C
  Bottom 0.203: D6.C 67.31,94.61 66.04,93.34 66.04,84.45 67.31,83.19 D16.C 67.31,74.93 67.94,74.93 68.58,74.3 68.58,61.59 67.31,60.33 D26.C 67.31,57.15 66.67,57.15 66.04,56.52 66.04,46.99 | DM5B.C 29.21,47.62 30.48,46.35 32.38,46.35 DM5D.C 36.2,46.35 40.64,46.35 41.91,47.62 DM5F.C | D36.C 67.31,46.99 66.04,46.99 | 66.04,46.99 49.53,46.99 48.26,48.26 DM5G.C
STATE6  (via drill 0.51)
  Top 0.203: DM6F.C DM6G.C | DM6A.C DM6B.C | JP9.7 D57.C 69.85,12.06 68.58,13.34 v68.58,19.05 | D47.C 69.85,29.84 68.58,31.11 v68.58,36.83 | v64.77,43.81 65.41,44.45 69.22,44.45 69.22,43.18 69.85,42.55 D37.C
  Bottom 0.203: D7.C 69.85,92.71 69.22,92.71 68.58,92.08 68.58,79.38 69.85,78.11 D17.C 69.85,76.83 71.12,75.56 71.12,66.67 69.85,65.41 D27.C 69.85,57.15 70.48,57.15 71.12,56.52 71.12,43.81 69.85,42.55 D37.C 69.85,41.27 68.58,40.01 v68.58,36.83 | 40.01,36.83 DM6E.C | 40.01,36.83 DM6D.C | DM6B.C 34.29,39.37 37.47,39.37 | 37.47,39.37 40.01,36.83 | 46.99,39.37 DM6F.C | 37.47,39.37 46.99,39.37 | v68.58,19.05 68.58,22.23 69.85,23.5 D47.C | 46.99,39.37 52.7,45.09 63.5,45.09 v64.77,43.81
STATE7  (via drill 0.51)
  Top 0.203: D18.C 72.39,83.19 71.12,84.45 71.12,93.34 72.39,94.61 D8.C | DM7A.C 34.92,26.04 34.92,26.67 36.2,27.94 38.73,27.94 38.73,26.67 39.37,26.04 DM7C.C | JP9.8 D58.C 72.39,12.06 73.66,13.34 73.66,22.23 72.39,23.5 D48.C 72.39,29.84 71.12,31.11 71.12,40.01 72.39,41.27 D38.C 72.39,42.55 73.66,43.81 73.66,57.78 73.03,58.42 73.03,59.05 D28.C | DM7F.C 47.62,26.04 47.62,26.67 v48.9,27.94
  Bottom 0.203: DM7F.C 45.09,23.5 40.64,23.5 39.37,24.77 DM7C.C | v48.9,27.94 69.22,27.94 72.39,24.77 D48.C | D18.C 72.39,74.93 73.03,74.93 73.66,74.3 73.66,61.59 72.39,60.33 D28.C
STATE8  (via drill 0.51)
  Top 0.203: DM8F.C 45.09,14.61 45.09,15.24 46.35,16.51 48.9,16.51 48.9,15.24 49.53,14.61 DM8G.C 49.53,12.06 48.26,10.79 48.26,9.53 v51.44,6.35 | DM8B.C DM8A.C | v30.48,19.68 31.11,19.05 31.11,15.24 31.75,14.61 DM8C.C | JP9.9 D59.C 74.93,6.99 79.38,11.43 79.38,20.32 76.2,23.5 76.2,24.13 D49.C 74.93,24.77 79.38,29.21 79.38,38.1 76.2,41.27 76.2,41.91 D39.C 74.93,42.55 79.38,46.99 79.38,55.88 76.2,59.05 76.2,59.69 D29.C 74.93,60.33 79.38,64.77 79.38,73.66 76.2,76.83 76.2,77.47 D19.C 74.93,78.11 79.38,82.55 79.38,91.44 76.2,94.61 76.2,95.25 D9.C
  Bottom 0.203: DM8C.C 33.66,12.06 35.56,12.06 36.83,13.34 DM8D.C 38.73,13.97 | 38.73,13.97 DM8E.C | DM8B.C 29.21,23.5 30.48,22.23 v30.48,19.68 | DM8F.C 42.55,12.06 40.64,12.06 38.73,13.97 | v51.44,6.35 53.34,8.26 59.69,8.26 60.33,8.89 73.03,8.89 74.93,6.99 D59.C
STATE9
  Top 0.203: D30.C 80.01,59.69 80.01,74.3 | 80.01,74.3 77.47,76.83 D20.C | D10.C 80.01,95.25 80.01,74.3 | DM9F.C DM9G.C | JP9.10 D60.C 80.01,6.35 80.01,24.13 | 80.01,24.13 D50.C | 80.01,24.13 80.01,38.73 77.47,41.27 D40.C
  Bottom 0.203: DM9A.C 26.67,5.08 29.84,5.08 | 29.84,5.08 31.75,3.17 DM9B.C | 36.83,5.08 DM9C.C | 29.84,5.08 36.83,5.08 | 41.91,5.08 DM9D.C | 36.83,5.08 41.91,5.08 | 46.99,5.08 DM9F.C | 41.91,5.08 46.99,5.08 | 46.99,5.08 49.53,7.62 51.44,7.62 52.7,8.89 59.69,8.89 60.33,9.53 74.93,9.53 77.47,6.99 D60.C | D30.C 81.92,55.24 81.92,41.91 D40.C
VCC
  pour Top: 0,111.76 87.63,111.76 87.63,0 0,0

### Text on the board
tPlace: VCC | GND | 555 Seq Synth Matrix Module v0.9 by Clifford Wolf